# Altium schematic sheet UART.SchDoc
size A; SheetNumber: 10; SheetTotal: 11; ApprovedDate: 04/02/2019; AssemblyNumber: ECE315-F19
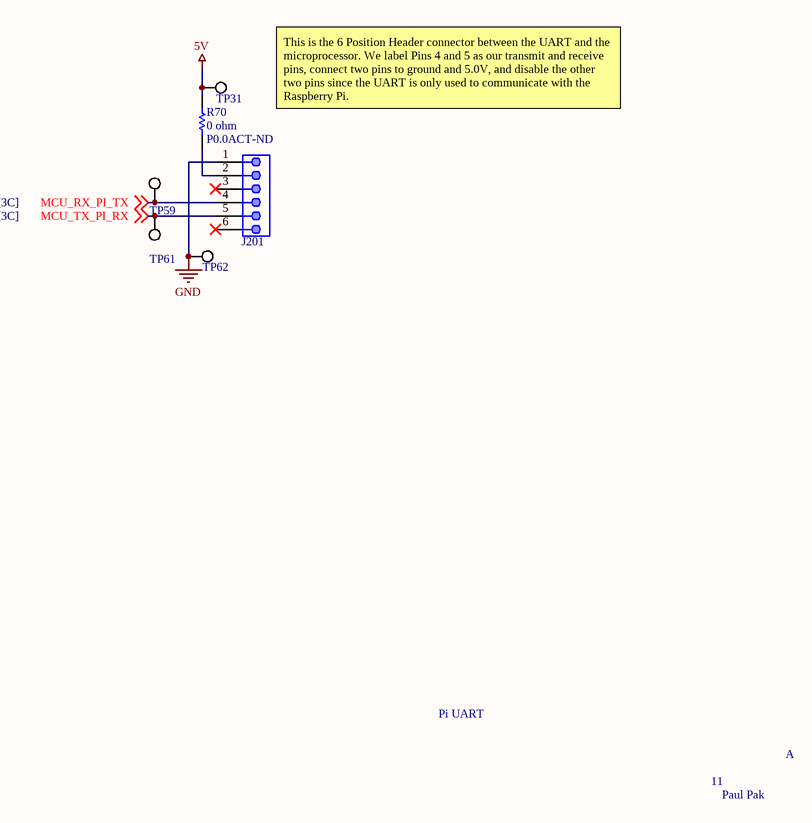
[diagram p0: UART.SchDoc]

## Parts
J201  (no value)  [HDR1X6]
R70  0 ohm  Supplier Part Number 1: P0.0ACT-ND  [RESC2013X70X40NL20T20]
TP31  5019  [KSTN-5019_V]  (value not drawn)
TP59  5019  [KSTN-5019_V]  (value not drawn)
TP61  5019  [KSTN-5019_V]  (value not drawn)
TP62  5019  [KSTN-5019_V]  (value not drawn)

## Nets
5V: R70.2 TP31.1
GND: J201.1 TP62.1
MCU_RX_PI_TX: J201.4 TP59.1 ; off-sheet MCU_RX_PI_TX
MCU_TX_PI_RX: J201.5 TP61.1 ; off-sheet MCU_TX_PI_RX
NetJ201_2: J201.2 R70.1

Not connected (* = marked no-connect by the designer): J201 3* 6*

## Notes on the sheet
- This is the 6 Position Header connector between the UART and the microprocessor. We label Pins 4 and 5 as our transmit and receive pins, connect two pins to ground and 5.0V, and disable the other two pins since the UART is only used to communicate with the Raspberry Pi.
- Pi UART
- 11
- A
- Paul Pak

## Library data of the parts
J201 = CONN_HEADER_MALE_1x6: Female, 6C, Rt Angle, .100"CC; 3.15mm Tail, No Mounting; PBT, Phos. Bronze, 105 C; Manufacturer 1: Sullins; Manufacturer Part Number 1: PPPC061LGBN-RC; Number of Positions: 6; Connector Type: Header; Pitch: 0.1inch; Supplier 1: Digi-Key; Supplier Part Number 1: S5481-ND; RoHS: Yes; Category: Connectors; Stock 1: 30480; Pricing 1: 1=0.66000, 10=0.56000, 80=0.50288, 440=0.41148, 1000=0.36576, 5000=0.33020 (USD); Mount: Through Hole; Color: Black; Contact Plating: Gold; Contact Material: Bronze; Housing Color: Black; Housing Material: Plastic; Package Quantity: 1000; Number of Rows: 1; Packaging: Bulk; Termination: Solder; Contact Type: Female Socket; Length: 15.7mm; Width: 8.5mm; Height: 2.4mm; Lead Free: Lead Free; RoHS Compliant: Yes; ComponentLink1URL: https://media.digikey.com/pdf/Data%20Sheets/Sullins%20PDFs/Female_Headers.100_DS.pdf?src-supplier=Digi-Key; ComponentLink1Description: https://media.digikey.com/pdf/Data%20Sheets/Sullins%20PDFs/Female_Headers.100_DS.pdf?src-supplier=Digi-Key; ComponentLink2URL: http://www.sullinscorp.com/catalogs/78_Page80-81_HEADER_.100_2.54mm_FEMALE.pdf?src-supplier=Future+Electronics; ComponentLink2Description: http://www.sullinscorp.com/catalogs/78_Page80-81_HEADER_.100_2.54mm_FEMALE.pdf?src-supplier=Future+Electronics
R70 = CMP-1665-00002-5: Chip Resistor, 0 Ohm, +/- 1%, 0.125 W, -55 to 155 degC, 0805 (2012 Metric), RoHS, Tape and Reel; PartNumber: ERJ-6GEY0R00V; Manufacturer: Panasonic; Tolerance: 5%; Value: 0R; Power Rating: 125mW; Temperature Coefficient: 600ppm/°C; Voltage Rating: 150V; Current Rating: 2A; REACH SVHC: No SVHC; Min Operating Temperature: -55 degC; Case/Package: 0805; Packaging: Tape and Reel; Package Quantity: 5000; ComponentLink1Description: Manufacturer URL; PackageDescription: 2-Pin Surface Mount Device, Body 2 x 1.25 mm; Mounting Technology: Surface Mount; Max Operating Temperature: 155 degC; Width: 1.25 mm; RoHSCompliant: True; Height: 0.6 mm; ComponentLink1URL: http://www.panasonic.com/; Resistance: 0 Ohm; ComponentLink2URL: http://industrial.panasonic.com/cdbs/www-data/pdf/RDA0000/AOA0000C84.pdf; Case Code (Imperial): 0805; DatasheetVersion: 03/2015; Length: 2 mm; Case Code (Metric): 2012; ComponentLink2Description: Datasheet; Radiation Hardening: No; Supplier 1: Digi-Key; Manufacturer Part Number: ERJ-6GEY0R00V; RoHS: Yes; Category: Chip SMD Resistors; Stock 1: 3172332; Pricing 1: 1=0.10000, 10=0.06400, 25=0.04680, 50=0.03560, 100=0.02620, 250=0.02000, 500=0.01598, 1000=0.01177 (USD); Contact Plating: Tin; Resistor Type: Thick Film; Series: ERJ; Termination: SMD/SMT; Number of Terminations: 2; Voltage Rating (DC): 150V; Construction: Rectangular; Max Power Dissipation: 125mW; Features: Automotive AEC-Q200; Technology: THICK FILM; Depth: 1.25mm; Ratings: AEC-Q200; RoHS Compliant: Yes; Lead Free: Lead Free; Military Standard: Not; Reach SVHC Compliant: Yes
TP31 TP59 TP61 TP62 = CMP-1672-00008-1: Test Point, 1 Position SMD, RoHS, Tape and Reel; Manufacturer: Keystone Electronics; Body Material: Bronze; Plating: Silver; ComponentLink1Description: Manufacturer URL; Package Quantity: 1000; DatasheetVersion: 03/2014; Packaging: Tape and Reel; ComponentLink2URL: http://www.keyelco.com/product-pdf.cfm?p=1357; ComponentLink1URL: http://www.keyelco.com/; Mount: Surface Mount; Contact Plating: Silver; PackageDescription: 1-Pin Surface Mount Device, Body 3.81 x 2.03 mm; Pins: 1; RoHSCompliant: True; Mounting Technology: Surface Mount; ComponentLink2Description: Datasheet; PackageReference: 5019; Supplier 1: Digi-Key; Supplier Part Number 1: 36-5019CT-ND; Manufacturer Part Number: 5019; RoHS: Yes; Category: Connectors; Stock 1: 1009631; Pricing 1: 1=0.34000, 25=0.27360, 100=0.22340, 250=0.20064, 500=0.19152 (USD); Number of Pins: 1; Material: Bronze; Contact Material: Bronze; Series: 5019; Termination: SMD/SMT; Height: 0.09inch; RoHS Compliant: Yes; Reach SVHC Compliant: Yes; Lead Free: Lead Free; ComponentLink3URL: https://datasheet.ciiva.com/16885/70182998-16885945.pdf?src-supplier=Allied+Electronics; ComponentLink3Description: https://datasheet.ciiva.com/16885/70182998-16885945.pdf?src-supplier=Allied+Electronics; ComponentLink4URL: https://datasheet.ciiva.com/14848/m60-2p61-14848437.pdf?src-supplier=Digi-Key; ComponentLink4Description: https://datasheet.ciiva.com/14848/m60-2p61-14848437.pdf?src-supplier=Digi-Key; ComponentLink5URL: https://datasheet.ciiva.com/14848/m60-2p61-14848438.pdf?src-supplier=Digi-Key; ComponentLink5Description: https://datasheet.ciiva.com/14848/m60-2p61-14848438.pdf?src-supplier=Digi-Key; ComponentLink6URL: https://datasheet.ciiva.com/14848/m60-2p61-14848439.pdf?src-supplier=Digi-Key; ComponentLink6Description: https://datasheet.ciiva.com/14848/m60-2p61-14848439.pdf?src-supplier=Digi-Key; ComponentLink7URL: https://datasheet.ciiva.com/16318/m60-2p61-16318395.pdf?src-supplier=Future+Electronics; ComponentLink7Description: https://datasheet.ciiva.com/16318/m60-2p61-16318395.pdf?src-supplier=Future+Electronics